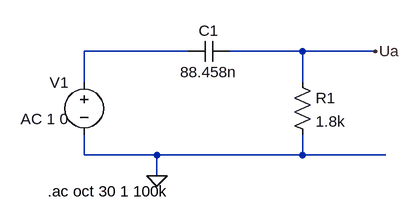
[diagram p0: schematic Lab7RCHochpass.asc]
Lab7RCHochpass.asc, the LTspice schematic file:
Version 4
SHEET 1 880 680
WIRE 256 96 96 96
WIRE 432 96 320 96
WIRE 544 96 432 96
WIRE 96 144 96 96
WIRE 432 144 432 96
WIRE 96 256 96 224
WIRE 208 256 96 256
WIRE 432 256 432 224
WIRE 432 256 208 256
WIRE 560 256 432 256
WIRE 208 288 208 256
FLAG 208 288 0
FLAG 544 96 Ua
SYMBOL voltage 96 128 M0
WINDOW 3 24 44 Left 2
WINDOW 123 24 72 Left 2
WINDOW 39 0 0 Left 0
SYMATTR InstName V1
SYMATTR Value ""
SYMATTR Value2 AC 1 0
SYMBOL cap 320 80 R90
WINDOW 0 0 32 VBottom 2
WINDOW 3 32 32 VTop 2
SYMATTR InstName C1
SYMATTR Value 88.458n
SYMBOL res 416 128 R0
SYMATTR InstName R1
SYMATTR Value 1.8k
TEXT 40 312 Left 2 !.ac oct 30 1 100k

The netlist it stands for:
* Lab7RCHochpass.asc
V1 N001 0 AC 1 0
C1 Ua N001 88.458n
R1 Ua 0 1.8k
.ac oct 30 1 100k
.backanno
.end